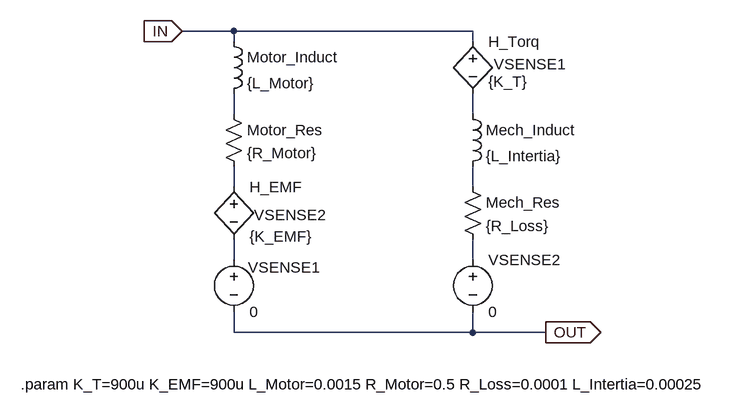
[diagram p0: schematic GenericDCMotorModel.asc]
GenericDCMotorModel.asc, the LTspice schematic file:
Version 4
SHEET 1 1356 808
WIRE 176 64 96 64
WIRE 544 64 176 64
WIRE 176 80 176 64
WIRE 544 80 544 64
WIRE 176 192 176 160
WIRE 544 192 544 160
WIRE 176 304 176 272
WIRE 544 304 544 272
WIRE 176 416 176 384
WIRE 544 416 544 384
WIRE 176 528 176 496
WIRE 544 528 544 496
WIRE 544 528 176 528
WIRE 656 528 544 528
FLAG 96 64 IN
IOPIN 96 64 In
FLAG 656 528 OUT
IOPIN 656 528 Out
SYMBOL ind 160 64 R0
SYMATTR InstName Motor_Induct
SYMATTR Value {L_Motor}
SYMBOL res 160 176 R0
SYMATTR InstName Motor_Res
SYMATTR Value {R_Motor}
SYMBOL voltage 176 400 R0
WINDOW 0 22 28 Left 2
SYMATTR InstName VSENSE1
SYMATTR Value 0
SYMBOL voltage 544 400 R0
WINDOW 123 0 0 Left 2
WINDOW 39 0 0 Left 2
SYMATTR InstName VSENSE2
SYMATTR Value 0
SYMBOL ind 528 176 R0
SYMATTR InstName Mech_Induct
SYMATTR Value {L_Intertia}
SYMBOL res 528 288 R0
SYMATTR InstName Mech_Res
SYMATTR Value {R_Loss}
SYMBOL h 176 288 R0
WINDOW 3 31 59 Left 2
WINDOW 123 24 92 Left 2
SYMATTR Value VSENSE2
SYMATTR Value2 {K_EMF}
SYMATTR InstName H_EMF
SYMBOL h 544 64 R0
WINDOW 123 24 78 Left 2
WINDOW 3 32 51 Left 2
SYMATTR Value2 {K_T}
SYMATTR Value VSENSE1
SYMATTR InstName H_Torq
TEXT -152 608 Left 2 !.param K_T=900u K_EMF=900u L_Motor=0.0015 R_Motor=0.5 R_Loss=0.0001 L_Intertia=0.00025

The netlist it stands for:
* GenericDCMotorModel.asc
L§Motor_Induct IN N001 {L_Motor}
R§Motor_Res N001 N003 {R_Motor}
VSENSE1 N005 OUT 0
VSENSE2 N006 OUT 0
L§Mech_Induct N002 N004 {L_Intertia}
R§Mech_Res N004 N006 {R_Loss}
H_EMF N003 N005 VSENSE2 {K_EMF}
H_Torq IN N002 VSENSE1 {K_T}
.param K_T=900u K_EMF=900u L_Motor=0.0015 R_Motor=0.5 R_Loss=0.0001 L_Intertia=0.00025
.backanno
.end